# Altium schematic sheet Top.SchDoc
size 406 x 304 mm; SheetNumber: 1; SheetTotal: 8
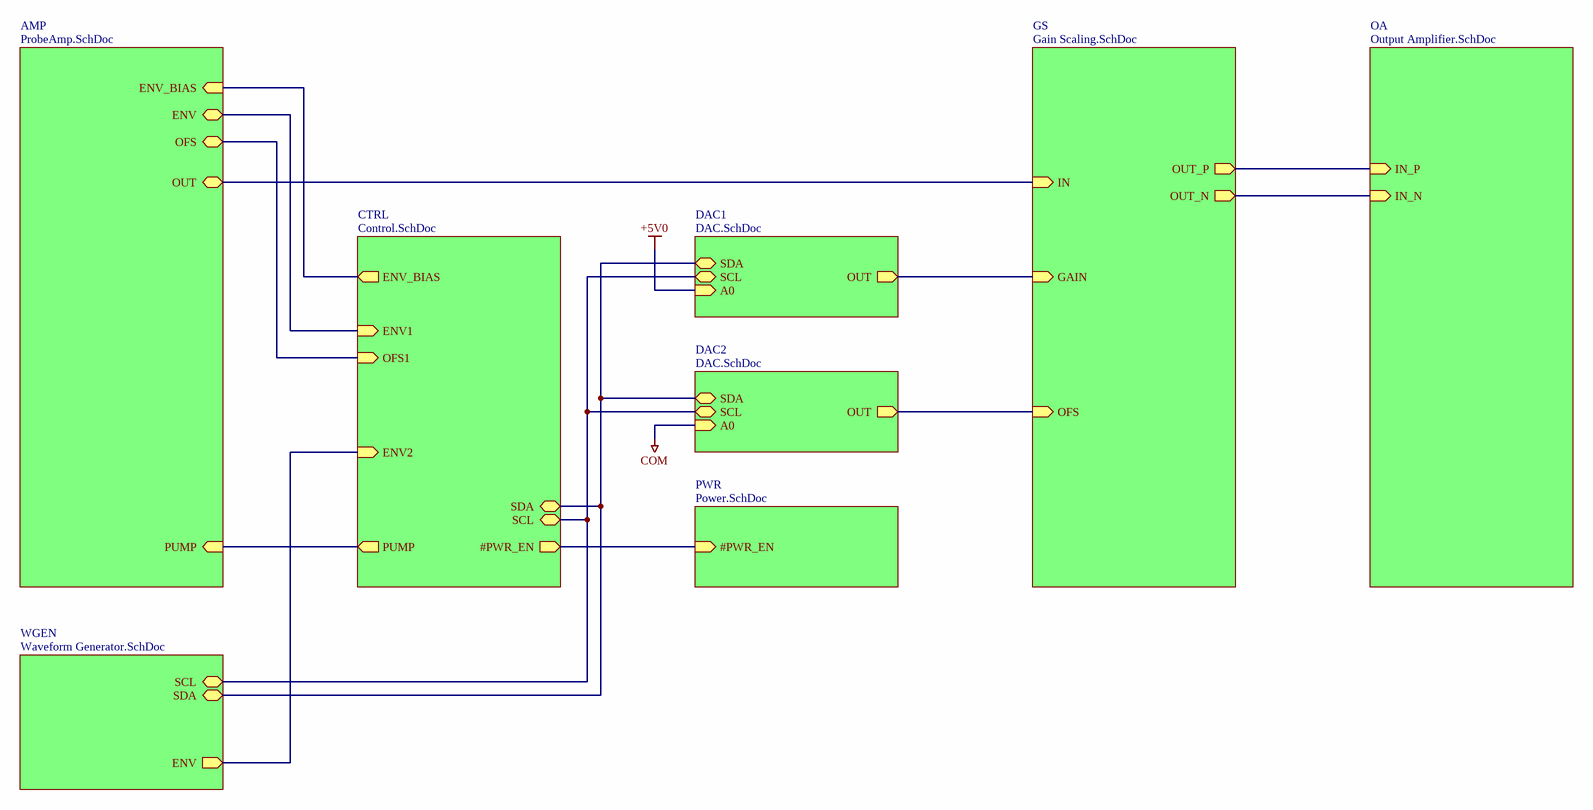
[diagram p0: Top.SchDoc]

## Sub-sheets
AMP = ProbeAmp.SchDoc: OUT (bidir), OFS (bidir), ENV (bidir), ENV_BIAS (in), PUMP (in)
CTRL = Control.SchDoc: OFS1 (in), ENV1 (in), ENV2 (in), SCL (bidir), SDA (bidir), #PWR_EN (out), PUMP (out), ENV_BIAS (out)
DAC1 = DAC.SchDoc: OUT (out), SCL (bidir), SDA (bidir), A0 (in)
DAC2 = DAC.SchDoc: OUT (out), SCL (bidir), SDA (bidir), A0 (in)
GS = Gain Scaling.SchDoc: IN (in), OUT_P (out), OUT_N (out), GAIN (in), OFS (in)
OA = Output Amplifier.SchDoc: IN_P (in), IN_N (in)
PWR = Power.SchDoc: #PWR_EN (in)
WGEN = Waveform Generator.SchDoc: SCL (bidir), SDA (bidir), ENV (out)

## Nets
+5V0: sheet DAC1/A0
COM: sheet DAC2/A0
(unnamed): sheet PWR/#PWR_EN, sheet CTRL/#PWR_EN
(unnamed): sheet AMP/OUT, sheet GS/IN
(unnamed): sheet AMP/OFS, sheet CTRL/OFS1
(unnamed): sheet AMP/ENV, sheet CTRL/ENV1
(unnamed): sheet AMP/ENV_BIAS, sheet CTRL/ENV_BIAS
(unnamed): sheet AMP/PUMP, sheet CTRL/PUMP
(unnamed): sheet DAC1/OUT, sheet GS/GAIN
(unnamed): sheet DAC1/SCL, sheet DAC2/SCL, sheet CTRL/SCL, sheet WGEN/SCL
(unnamed): sheet DAC1/SDA, sheet DAC2/SDA, sheet CTRL/SDA, sheet WGEN/SDA
(unnamed): sheet DAC2/OUT, sheet GS/OFS
(unnamed): sheet CTRL/ENV2, sheet WGEN/ENV
(unnamed): sheet GS/OUT_P, sheet OA/IN_P
(unnamed): sheet GS/OUT_N, sheet OA/IN_N

## Notes on the sheet
- Sheet Name:
- Date:
- Sheet
- Designer:
- of